# Altium schematic sheet Sheet1.SchDoc
size A4
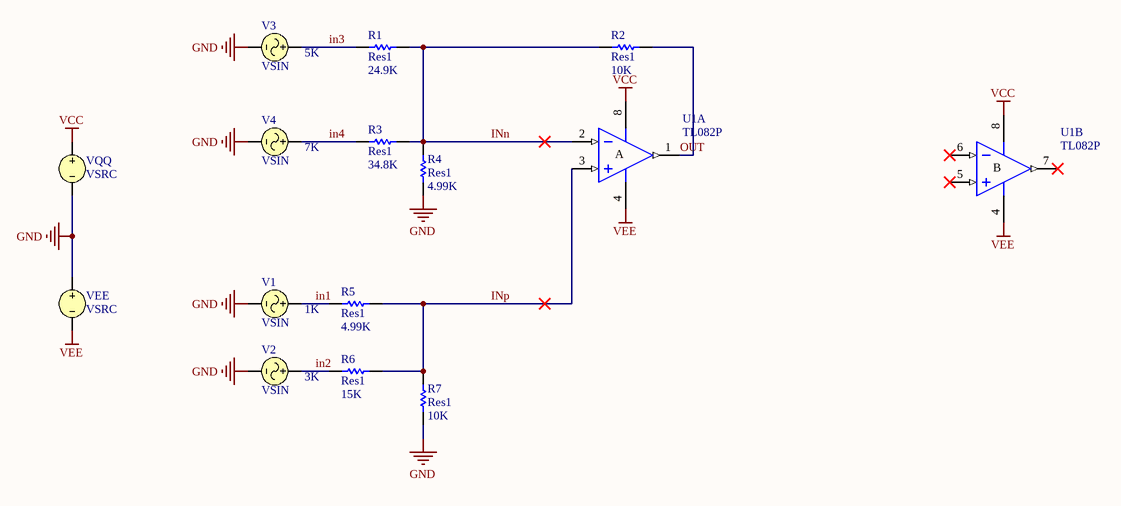
[diagram p0: Sheet1.SchDoc]

## Parts
R1  Res1  value 24.9K  [AXIAL-0.3]
R2  Res1  value 10K  [AXIAL-0.3]
R3  Res1  value 34.8K  [AXIAL-0.3]
R4  Res1  value 4.99K  [AXIAL-0.3]
R5  Res1  value 4.99K  [AXIAL-0.3]
R6  Res1  value 15K  [AXIAL-0.3]
R7  Res1  value 10K  [AXIAL-0.3]
U1  TL082P  [P008]  (parts A,B of 2)
V1  VSIN  Frequency: 1K
V2  VSIN  Frequency: 3K
V3  VSIN  Frequency: 5K
V4  VSIN  Frequency: 7K
VEE  VSRC
VQQ  VSRC

## Nets
GND: R4.1 R7.1 V1.2 V2.2 V3.2 V4.2 VEE.1 VQQ.2
VCC: U1.8(V+) VQQ.1
VEE: U1.4(V-) VEE.2
in1: R5.1 V1.1
in2: R6.1 V2.1
in3: R1.1 V3.1
in4: R3.1 V4.1
INn: R1.2 R2.1 R3.2 R4.2 U1.2(IN-)
INp: R5.2 R6.2 R7.2 U1.3(IN+)
OUT: R2.2 U1.1(OUT)

Not connected (* = marked no-connect by the designer): U1 5(IN+)* 6(IN-)* 7(OUT)*

## Notes on the sheet
- (in symbol TL082P, part A) A
- (in symbol TL082P, part B) B

## Library data of the parts
R1-R7 = Res1: Resistor; Published: 8-Jun-2000; LatestRevisionDate: 17-Jul-2002; LatestRevisionNote: Re-released for DXP Platform.; PackageReference: AXIAL-0.3; Publisher: Altium Limited; PackageDescription: Axial Device, Thru-Hole; 2 Leads; 0.3 in Pin Spacing
U1 = TL082P: JFET-Input Operational Amplifier; Published: 16-Jan-2001; LatestRevisionDate: 04-Mar-2005; LatestRevisionNote: Stylized 3D Model Added.; DatasheetVersion: Feb-1999; PackageVersion: Jun-1999; PackageReference: P008; Publisher: Altium Limited; PackageDescription: DIP; 8 Leads; Row Spacing 7.62 mm; Pitch 2.54 mm; Code_JEDEC: MO-001-AN; ComponentLink1Description: Manufacturer Link; ComponentLink1URL: http://www.ti.com/; ComponentLink2Description: Datasheet; ComponentLink2URL: http://www-s.ti.com/sc/ds/tl082.pdf
V1 V2 = VSIN: Sinusoidal Voltage Source; Note: PCB Footprint - Not required; Amplitude: 1; Phase: 0; Published: 8-Jun-2000; LatestRevisionDate: 15-Nov-2004; LatestRevisionNote: Corrected Netlist.; PackageReference: Not Applicable; Publisher: Altium Limited
V3 V4 = VSIN: Sinusoidal Voltage Source; Note: PCB Footprint - Not required; Amplitude: 1; Phase: 180; Published: 8-Jun-2000; LatestRevisionDate: 15-Nov-2004; LatestRevisionNote: Corrected Netlist.; PackageReference: Not Applicable; Publisher: Altium Limited
VEE VQQ = VSRC: Voltage Source; Note: PCB Footprint - Not required; Value: 15V; Published: 8-Jun-2000; LatestRevisionDate: 17-Jul-2002; LatestRevisionNote: Re-released for DXP Platform.; PackageReference: Not Applicable; Publisher: Altium Limited